# EAGLE design Pong Hat voor Raspberry Pi Rev 3 SOIC (EAGLE 7.3.0)
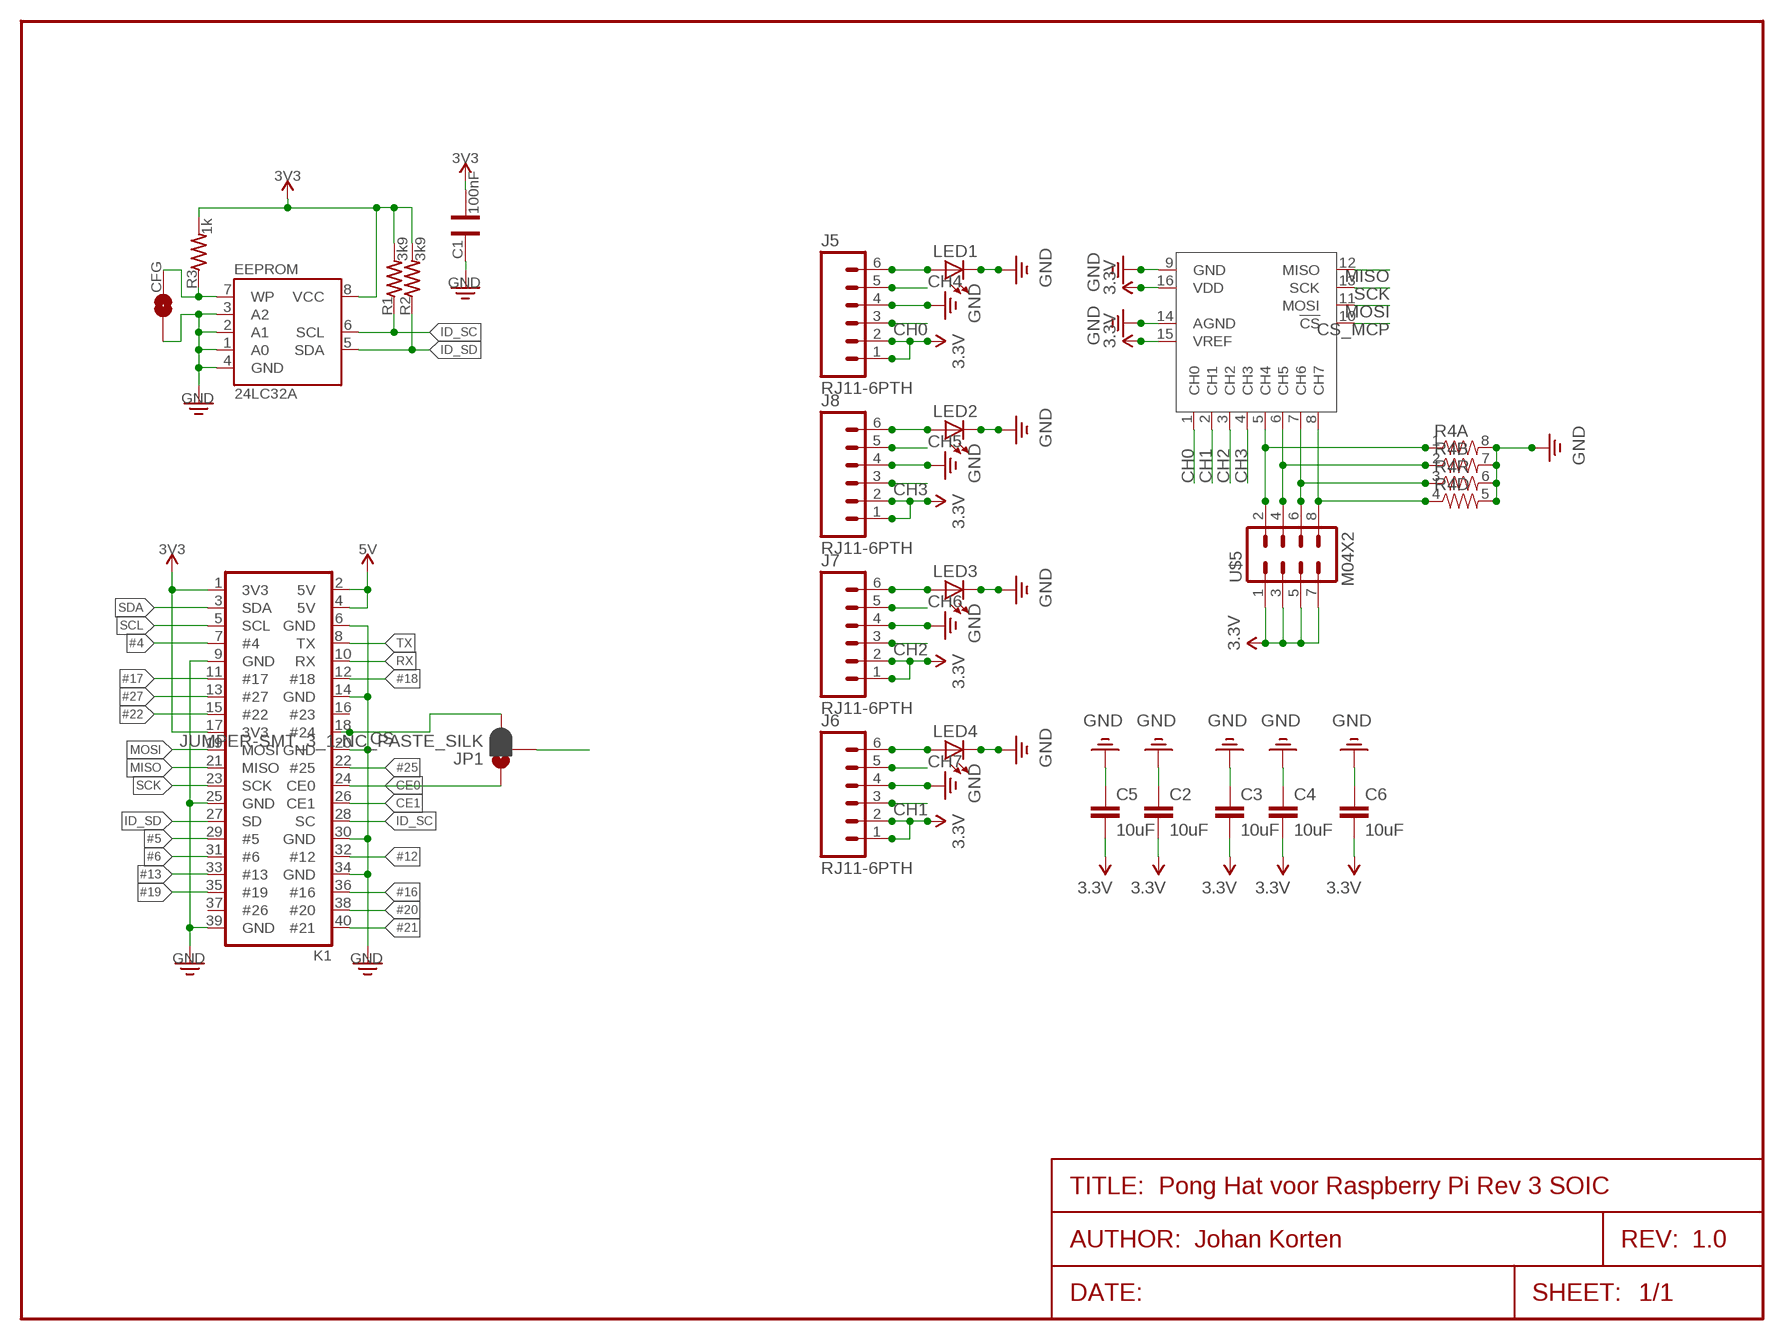
[diagram p0: schematic, sheet 1]
FRAME1 (FRAME-LETTER): AUTHOR: Johan Korten; REV: 1.0

## Parts
C1  100nF  CAP0603  [CAP-0603]
C2  10uF  10UF-0805-10V-10%  [0805]
C3  10uF  10UF-0805-10V-10%  [0805]
C4  10uF  10UF-0805-10V-10%  [0805]
C5  10uF  10UF-0805-10V-10%  [0805]
C6  10uF  10UF-0805-10V-10%  [0805]
CFG  1X02-SJ-NO  [1X02-SJ-NO]
EEPROM  24LC32A  [SO08-EIAJ]
J5  RJ11-6PTH  [RJ11-6]
J6  RJ11-6PTH  [RJ11-6]
J7  RJ11-6PTH  [RJ11-6]
J8  RJ11-6PTH  [RJ11-6]
JP1  JUMPER-SMT_3_1-NC_PASTE_SILK  [SMT-JUMPER_3_1-NC_PASTE_SILK]
K1  2X20-RPI-ALT  [2X20-RPI-ALT]
LED1  LEDCHIP-LED0805  [CHIP-LED0805]
LED2  LEDCHIP-LED0805  [CHIP-LED0805]
LED3  LEDCHIP-LED0805  [CHIP-LED0805]
LED4  LEDCHIP-LED0805  [CHIP-LED0805]
R1  3k9  RES0603  [RES-0603]
R2  3k9  RES0603  [RES-0603]
R3  1k  RES0603  [RES-0603]
R4  RESISTOR-ARRAY0603-ARV  [0603-ARV]
U$5  M04X2  [2X4]
U$7  MCP3008SL  [SO16]

## Nets
3.3V: C1.1 C2.2 C3.2 C4.2 C5.2 C6.2 EEPROM.8(VCC) J5.1 J5.2 J6.1 J6.2 J7.1 J7.2 J8.1 J8.2 K1.1(3V3) K1.17(3V3) R1.2 R2.2 R3.2 U$5.1 U$5.3 U$5.5 U$5.7 U$7.15(VREF) U$7.16(VDD) ; supply symbol labelled 3V3
5V: K1.2(5V) K1.4(5V)
#4: K1.7(#4)
#5: K1.29(#5)
#6: K1.31(#6)
#12: K1.32(#12)
#13: K1.33(#13)
#16: K1.36(#16)
#17: K1.11(#17)
#18: K1.12(#18)
#19: K1.35(#19)
#20: K1.38(#20)
#21: K1.40(#21)
#22: K1.15(#22)
#25: K1.22(#25)
#27: K1.13(#27)
CE0: JP1.1 K1.24(CE0)
CE1: K1.26(CE1)
CH0: J5.3 U$7.1(CH0)
CH1: J6.3 U$7.2(CH1)
CH2: J7.3 U$7.3(CH2)
CH3: J8.3 U$7.4(CH3)
CH4: J5.5 R4.1 U$5.2 U$7.5(CH4)
CH5: J8.5 R4.2 U$5.4 U$7.6(CH5)
CH6: J7.5 R4.3 U$5.6 U$7.7(CH6)
CH7: J6.5 R4.4 U$5.8 U$7.8(CH7)
CS: JP1.3 K1.18(#24)
CS_MCP: JP1.2 U$7.10(!CS)
GND: C1.2 C2.1 C3.1 C4.1 C5.1 C6.1 CFG.1 EEPROM.1(A0) EEPROM.2(A1) EEPROM.3(A2) EEPROM.4(GND) J5.4 J6.4 J7.4 J8.4 K1.6(GND) K1.9(GND) K1.14(GND) K1.20(GND) K1.25(GND) K1.30(GND) K1.34(GND) K1.39(GND) LED1.C LED2.C LED3.C LED4.C R4.5 R4.6 R4.7 R4.8 U$7.9(GND) U$7.14(AGND)
ID_SC: EEPROM.6(SCL) K1.28(SC) R1.1
ID_SD: EEPROM.5(SDA) K1.27(SD) R2.1
MISO: K1.21(MISO) U$7.12(MISO)
MOSI: K1.19(MOSI) U$7.11(MOSI)
N$1: J8.6 LED2.A
N$2: J7.6 LED3.A
N$3: CFG.2 EEPROM.7(WP) R3.1
N$4: J6.6 LED4.A
N$16: J5.6 LED1.A
RX: K1.10(RX)
SCK: K1.23(SCK) U$7.13(SCK)
SCL: K1.5(SCL)
SDA: K1.3(SDA)
TX: K1.8(TX)
Unconnected: K1.16(#23) K1.37(#26)

## Library data of the parts
C1 = Ai_Passives:CAP; DIELECTRIC: X7R
C2-C6 = SparkFun-Capacitors:10UF: 10.0µF ceramic capacitors A capacitor is a passive two-terminal electrical component used to store electrical energy temporarily in an electric field.; PROD_ID: CAP-11330
CFG = Ai_Connectors:1X02-SJ-NO: A.I. Device 1x02-SJ-* NC has a large amount of paste (see paste layer) so that it should jumper during reflow. Remember that we have a version with a buil-in trace, which needs to be cut in order to have the jumper be NO.
EEPROM = Ai_IC:24LC32A
J5-J8 = SparkFun:RJ11-6: RJ11 Jack Simple 6 pin RJ11 jack. Commonly found on CAT3 devices and Microchip programmers. SKU: PRT-00132
JP1 = SparkFun-Jumpers:JUMPER-SMT_3_1-NC_PASTE: Normally closed solder jumper (1 of 2 connections) This jumper has an aperture in the stencil to allow solder paste to bridge one of the two connections. One connection is normally closed (NC), while the other is normally open (NO). Wick off the solder to open the connection. Reapply solder to reclose the connection. Apply solder to the other side instead to change the current path.
K1 = Ai_Connectors:2X20-RPI
LED1-LED4 = adafruit:LED: LED OSRAM: - CHIPLED LG R971, LG N971, LY N971, LG Q971, LY Q971, LO R971, LY R971 LH N974, LH R974 LS Q976, LO Q976, LY Q976 LO Q996 - Hyper CHIPLED LW Q18S LB Q993, LB Q99A, LB R99A - SideLED LS A670, LO A670, LY A670, LG A670, LP A670 LB A673, LV A673, LT A673, LW A673 LH A674 LY A675 LS A676, LA A676, LO A676, LY A676, LW A676 LS A679, LY A679, LG A679 - Hyper Micro SIDELED® LS Y876, LA Y876, LO Y876, LY Y876 LT Y87S - SmartLED LW L88C, LW L88S LB L89C, LB L89S, LG L890 LS L89K, LO L89K, LY L89K LS L896, LA L896, LO L896, LY L896 - TOPLED LS T670, LO T670, LY T670, LG T670, LP T670 LSG T670, LSP T670, LSY T670, LOP T670, LYG T670 LG T671, LOG T671, LSG T671 LB T673, LV T673, LT T673, LW T673 LH T674 LS T676, LA T676, LO T676, LY T676, LB T676, LH T676, LSB T676, LW T676 LB T67C, LV T67C, LT T67C, LS T67K, LO T67K, LY T67K, LW E67C LS E67B, LA E67B, LO E67B, LY E67B, LB E67C, LV E67C, LT E67C LW T67C LS T679, LY T679, LG T679 LS T770, LO T770, LY T770, LG T770, LP T770 LB T773, LV T773, LT T773, LW T773 LH T774 LS E675, LA E675, LY E675, LS T675 LS T776, LA T776, LO T776, LY T776, LB T776 LHGB T686 LT T68C, LB T68C - Hyper Mini TOPLED® LB M676 - Mini TOPLED Santana® LG M470 LS M47K, LO M47K, LY M47K Source: http://www.osram.convergy.de/
R1-R3 = Ai_Passives:RES: Part # blah Digikey; TOLERANCE: 5%
R4 = SparkFun-Resistors:RESISTOR-ARRAY: Array Chip Resistor Source: RS Component / Phycomp
U$5 = SparkFun:M04X2
U$7 = MCP3008:MCP3008

## Board
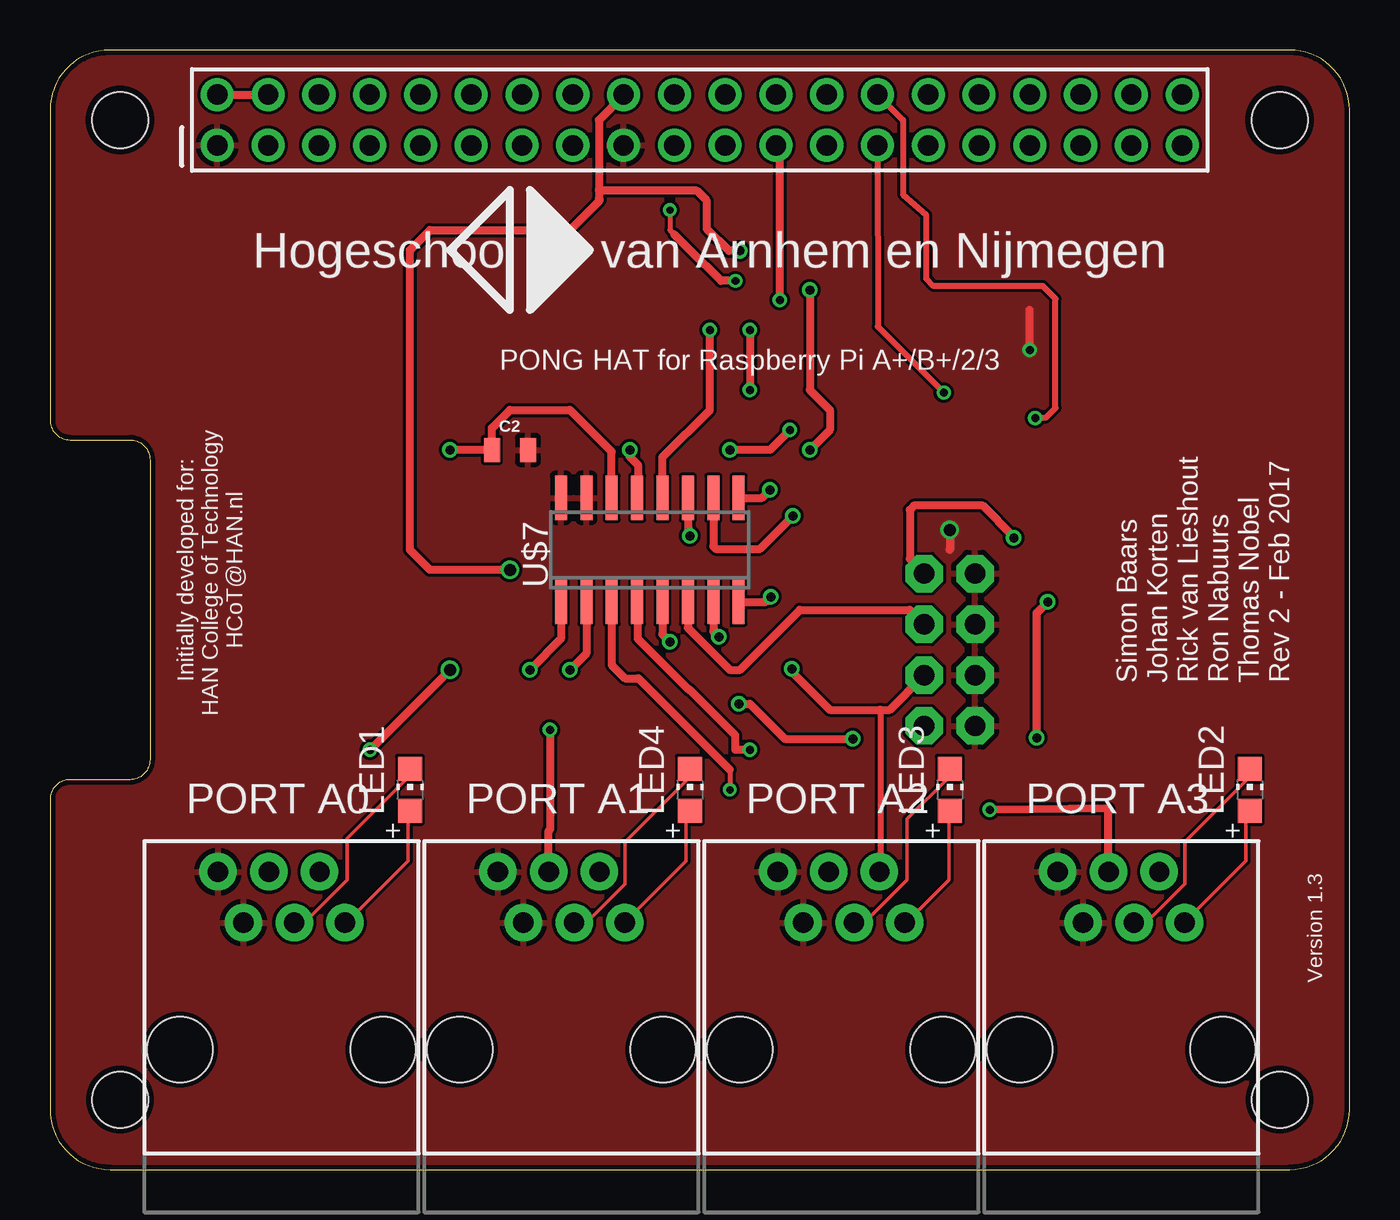
[diagram p1: board, top side]
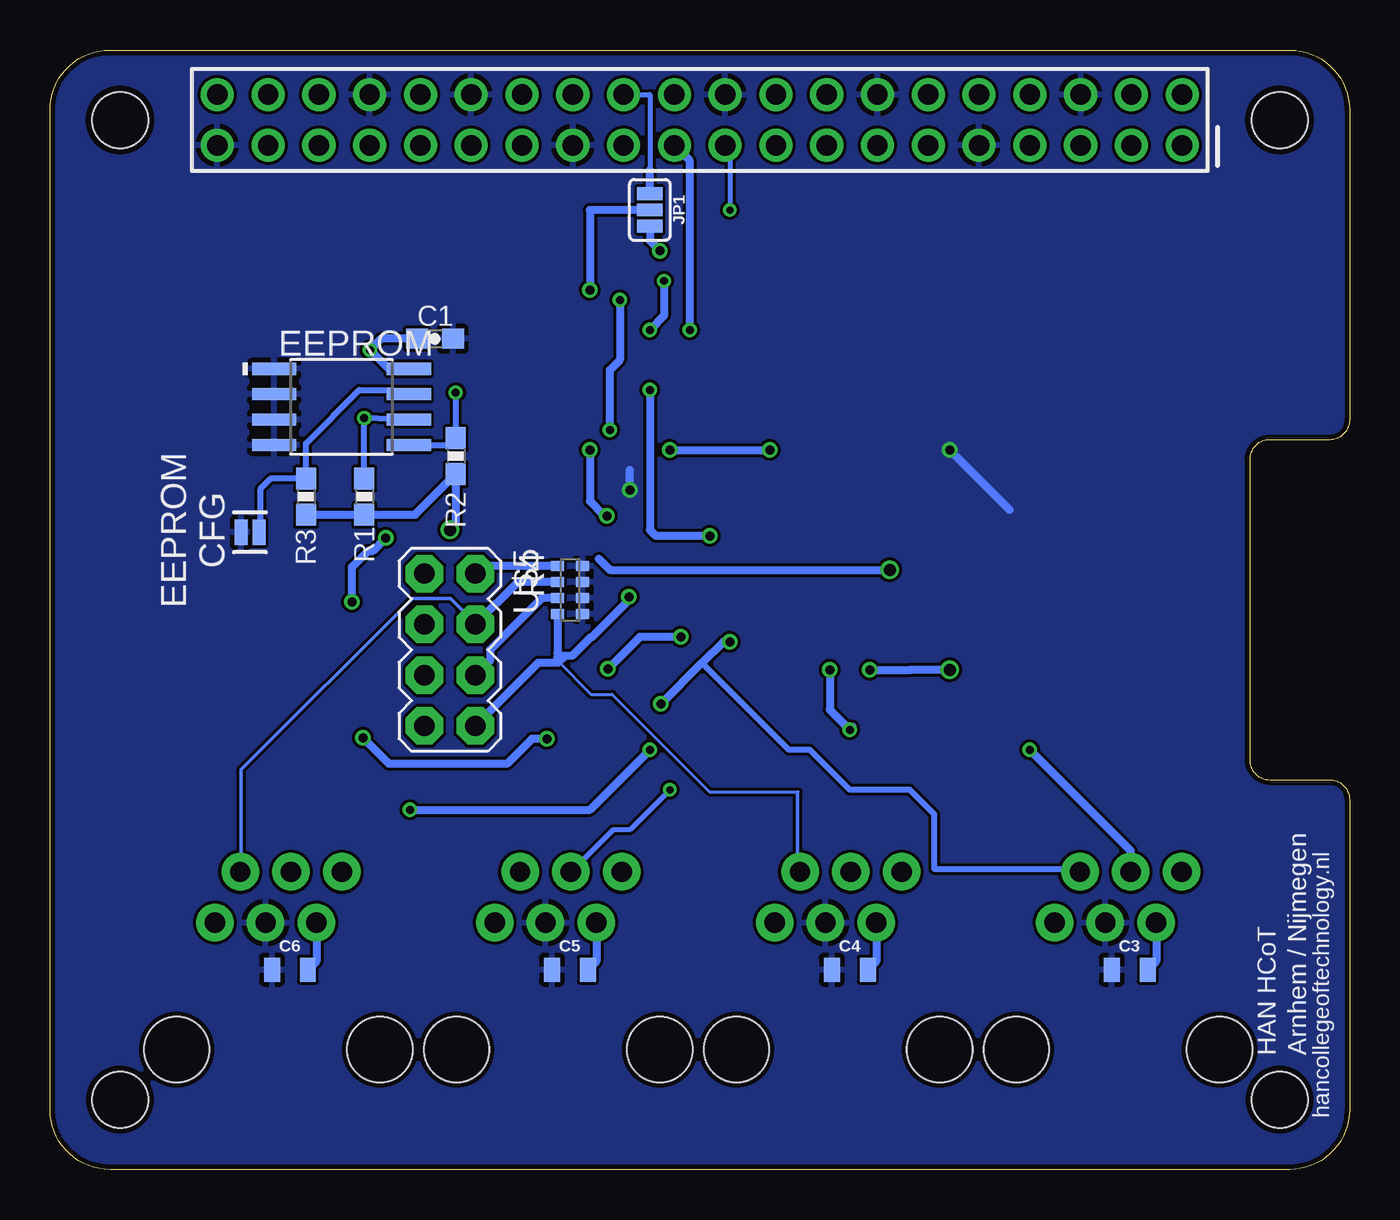
[diagram p2: board, bottom side, seen from below]

Size 65 x 56 mm. Coordinates in mm from the lower left corner, seen from the top.
Outline: 0,3 arc90 3,0 62,0 arc90 65,3 65,53 arc90 62,56 3,56 arc90 0,53 0,37.5 arc90 1,36.5 4,36.5 arc-90 5,35.5 5,20.5 arc-90 4,19.5 1,19.5 arc90 0,18.5 0,3
Copper layers (1*16): Top 0.035mm / dielectric 1.5mm / Bottom 0.035mm
Design rules "ITEADstudioDRC": minimum track width 6mil, minimum drill 12mil, track to track 6mil, track to pad 6mil, pad to pad 6mil, via to via 6mil, smd to smd 0mil, copper to edge 10mil, drill to drill 10mil, minimum pad ring 10mil, minimum via ring 6mil, stop-mask expansion 2mil, vias tented up to drill 100mil, thermal gap 10mil
Holes 2.8 mm at 3.5,3.5 3.5,52.5 61.5,52.5 61.5,3.5
tRestrict: area 1.9,51 to 5,54; area 60,51 to 63,54; area 60,1.9 to 63,5; area 1.9,1.9 to 5,5
bRestrict: area 1.9,1.9 to 5,5; area 1.9,51 to 5,54; area 60,1.9 to 63,5; area 60,51 to 63,54

### Footprints (pad centres in the part's own frame; a part is rotated, then mirrored left to right if it is on the bottom)
CAP-0603 = smd 1.1 x 1: 1 -0.9,0; 2 0.9,0
0805 = smd 0.8 x 1.2: 1 -0.9,0; 2 0.9,0
1X02-SJ-NO = smd 0.635 x 1.27: 1 -0.45,0; 2 0.45,0
SO08-EIAJ = smd 0.61 x 2.21: 1 -1.905,-3.378; 2 -0.635,-3.378; 3 0.635,-3.378; 4 1.905,-3.378; 5 1.905,3.353; 6 0.635,3.353; 7 -0.635,3.353; 8 -1.905,3.353
RJ11-6 = drill 1.016 pad 1.88: 1 1.905,8.89; 2 3.175,6.35; 3 4.445,8.89; 4 5.715,6.35; 5 6.985,8.89; 6 8.255,6.35 | hole 3.251: 0,0; 10.16,0
SMT-JUMPER_3_1-NC_PASTE_SILK = smd 0.635 x 1.27: 1 -0.813,0; 2 0,0; 3 0.813,0
2X20-RPI-ALT = drill 1.016 pad 1.651: 1 -24.13,-1.27; 2 -24.13,1.27; 3 -21.59,-1.27; 4 -21.59,1.27; 5 -19.05,-1.27; 6 -19.05,1.27; 7 -16.51,-1.27; 8 -16.51,1.27; 9 -13.97,-1.27; 10 -13.97,1.27; 11 -11.43,-1.27; 12 -11.43,1.27; 13 -8.89,-1.27; 14 -8.89,1.27; 15 -6.35,-1.27; 16 -6.35,1.27; 17 -3.81,-1.27; 18 -3.81,1.27; 19 -1.27,-1.27; 20 -1.27,1.27; 21 1.27,-1.27; 22 1.27,1.27; 23 3.81,-1.27; 24 3.81,1.27; 25 6.35,-1.27; 26 6.35,1.27; 27 8.89,-1.27; 28 8.89,1.27; 29 11.43,-1.27; 30 11.43,1.27; 31 13.97,-1.27; 32 13.97,1.27; 33 16.51,-1.27; 34 16.51,1.27; 35 19.05,-1.27; 36 19.05,1.27; 37 21.59,-1.27; 38 21.59,1.27; 39 24.13,-1.27; 40 24.13,1.27
CHIP-LED0805 = smd 1.2 x 1.2: A 0,-1.05; C 0,1.05
RES-0603 = smd 1.1 x 1: 1 -0.9,0; 2 0.9,0
0603-ARV = smd 0.5 x 0.65: 1 -1.2,-0.625; 2 -0.4,-0.625; 3 0.4,-0.625; 4 1.2,-0.625; 5 1.2,0.625; 6 0.4,0.625; 7 -0.4,0.625; 8 -1.2,0.625
2X4 = drill 1.016 pad 1.88 octagon: 1 -3.81,-1.27; 2 -3.81,1.27; 3 -1.27,-1.27; 4 -1.27,1.27; 5 1.27,-1.27; 6 1.27,1.27; 7 3.81,-1.27; 8 3.81,1.27
SO16 = smd 0.6 x 2.2: 1 -4.445,-2.6; 2 -3.175,-2.6; 3 -1.905,-2.6; 4 -0.635,-2.6; 5 0.635,-2.6; 6 1.905,-2.6; 7 3.175,-2.6; 8 4.445,-2.6; 9 4.445,2.6; 10 3.175,2.6; 11 1.905,2.6; 12 0.635,2.6; 13 -0.635,2.6; 14 -1.905,2.6; 15 -3.175,2.6; 16 -4.445,2.6

### Placement (x,y rotation side)
C1  45.75,41.55 0 bottom
C2  23,36 0 top
C3  11,10 0 bottom
C4  25,10 0 bottom
C5  39,10 0 bottom
C6  53,10 0 bottom
CFG  54.99,31.88 0 bottom
EEPROM  50.41,38.15 270 bottom
J5  6.5,6 0 top
J6  20.5,6 0 top
J7  34.5,6 0 top
J8  48.5,6 0 top
JP1  35,48 270 bottom
K1  32.5,52.5 0 top
LED1  18,19 0 top
LED2  60,19 0 top
LED3  45,19 0 top
LED4  32,19 0 top
R1  49.28,33.66 270 bottom
R2  44.7,35.69 270 bottom
R3  52.2,33.66 270 bottom
R4  39,29 270 bottom
U$5  45,26 270 bottom
U$7  30,31 0 top

### Tracks (layer width: path | path; a pad name or v marks a point on that pad's centre or on a via)
3.3V  (via drill 0.4, 0.6)
  Top 0.406: v49,41 49,43 | v45,32 45,31
  Bottom 0.305: 52.25,32.7 R3.2
  Bottom 0.406: EEPROM.8 48.05,40.05 v49,41 48.45,41.55 C1.1 46.65,41.65 | R3.2 R1.2 46.74,32.76 R2.2 44.7,32.3 v45,32 | J5.2 9.68,10.43 C3.2 | J6.2 23.68,10.43 C4.2 | J7.2 37.67,10.43 C5.2 | J8.2 51.67,10.43 C6.2
  pour Top: 0,3 arc90 3,0 62,0 arc90 65,3 65,53 arc90 62,56 3,56 arc90 0,53 0,37.5 arc90 1,36.5 4,36.5 arc-90 5,35.5 5,20.5 arc-90 4,19.5 1,19.5 arc90 0,18.5
5V
  Top 0.406: K1.2 K1.4
CE0
  Bottom 0.254: K1.24 35,53.77 35,50
  Bottom 0.406: JP1.1 35,50
CH0  (via drill 0.4, 0.45, 0.6)
  Top 0.406: v16,21 v20,25 | U$7.1 25.55,26.55 v24,25
  Bottom 0.406: J5.3 10.95,15.95 v16,21 | v20,25 21,25 21.95,25 v24,25
CH1  (via drill 0.4, 0.45)
  Top 0.406: v25,22 25,17 24.95,16.95 J6.3 | U$7.2 26.82,25.82 v26,25
  Bottom 0.406: 24.84,22.16 v25,22 26,23 v26,25
CH2  (via drill 0.35)
  Top 0.254: 34,20 v34,19
  Top 0.406: U$7.3 28.09,25.25 28.77,24.57 29.43,24.57 34,20
  Bottom 0.254: v34,19 36,17 36.84,17 J7.3
CH3  (via drill 0.4)
  Top 0.406: J8.3 52.95,18.05 v47,18 | v35,21 34.28,21 34.28,21.72 32,24 31.95,24 29.4,26.55 29.4,28.36 U$7.4
  Bottom 0.406: v47,18 38,18 v35,21
CH4  (via drill 0.45)
  Top 0.406: U$7.5 30.64,26.77 v31,26.4 | v34.45,23.3 35,23.3 36.75,21.55 v40.15,21.55 | v49.35,21.6 49.35,27.85 v49.9,28.4 | v48.2,31.6 48.2,31.65 46.65,33.2 43.2,33.2 43,33 43,30.54 U$5.2
  Bottom 0.178: 13.53,15.05 J5.5
  Bottom 0.305: 13.53,15.05 20.77,15.05 20.77,17.77 22,19 25,19 27,21 28.05,21 32.38,25.34
  Bottom 0.406: R4.1 43.34,30.2 U$5.2 | v31,26.4 31.32,26.4 32.38,25.34 32.41,25.34 v34.45,23.3 | v40.15,21.55 40.9,21.55 42.15,20.3 48.05,20.3 v49.35,21.6 | v49.9,28.4 49.9,30.15 49.1,30.95 48.85,30.95 v48.2,31.6
CH5
  Top 0.406: U$5.4 43,28 37.5,28 34.5,25 34,25 31.91,27.09 U$7.6
  Bottom 0.178: J8.5 55.44,15.05 55.44,20 46.86,28.57 44.96,28.57 43.81,27.43 U$5.4
  Bottom 0.406: R4.2 41.6,29.4 U$5.4
CH6  (via drill 0.45)
  Top 0.178: 41.53,15.05 J7.5
  Top 0.305: 41.53,23 41.53,15.05
  Top 0.406: U$5.6 42,23 41.53,23 39,23 37.1,24.9 v37.1,25.05 | U$7.7 33.17,26.93 v33.45,26.65
  Bottom 0.406: R4.3 40.4,28.6 43,26 43,25.46 U$5.6 | v33.45,26.65 35.5,26.65 v37.1,25.05
CH7  (via drill 0.45)
  Top 0.406: U$7.8 35.8,28.4 v36.05,28.65
  Bottom 0.152: 39.62,25.45 37.95,23.77 36.88,23.77 32,18.9 27.58,18.9 27.62,18.86
  Bottom 0.178: 27.62,18.86 27.62,15.05 J6.5
  Bottom 0.406: R4.4 39.62,25.81 39.51,25.7 | U$5.8 40.56,25.36 39.59,25.36 39.25,25.7 | v36.05,28.65 36.05,28.5 37.95,26.6 38,26.6 38.9,25.7 39.25,25.7 | 39.25,25.7 39.51,25.7 | 39.62,25.45 39.62,25.59 39.51,25.7
CS  (via drill 0.45, 0.6)
  Top 0.406: v23,30 19,30 18,31 18,46 19,47 26,47 27.5,48.5 27.45,48.55 27.45,49 | K1.18 28.69,53.74 27.45,52.5 27.45,49 | v34.5,45.95 33.95,45.95 32.85,47.05 32.85,48.45 32.35,48.95 27.5,48.95 27.45,49
  Bottom 0.406: 37.54,30.54 37,30 v23,30 | JP1.3 35,46.45 v34.5,45.95
CS_MCP  (via drill 0.45)
  Top 0.406: v38,44 38,39 39,38 39,37 v38,36 | U$7.10 33.17,31.18 33.3,31.05 35.5,31.05 v37.15,32.7
  Bottom 0.406: JP1.2 38,48 v38,44 | v38,36 38,33.43 37.27,32.7 v37.15,32.7
GND  (via drill 0.45)
  Top 0.178: LED1.C 17.91,20 17.91,19.62 14.86,16.57 14.86,14.48 12.76,12.38 12.38,12.38 J5.4 | LED4.C 31.81,20 31.81,19.43 28.77,16.38 28.77,14.29 26.86,12.38 26.29,12.38 J6.4 | LED3.C 44.96,20 44.96,19.62 42.86,17.53 42.86,14.48 40.77,12.38 40.39,12.38 J7.4 | LED2.C 59.82,20 59.82,19.43 56.77,16.38 56.77,14.29 54.86,12.38 54.29,12.38 J8.4
  Top 0.406: v20,36 C2.1 22.1,37.1 23,38 26,38 28.09,35.91 U$7.14 | U$7.9 35.6,33.6 v36,34
  Bottom 0.406: v20,36 17,33 | v36,34 36,35
  pour Bottom: 0,3 arc90 3,0 62,0 arc90 65,3 65,53 arc90 62,56 3,56 arc90 0,53 0,37.5 arc90 1,36.5 4,36.5 arc-90 5,35.5 5,20.5 arc-90 4,19.5 1,19.5 arc90 0,18.5
ID_SC  (via drill 0.4 pad 0.25)
  Top 0.305: K1.28 42.67,52.49 42.67,48.77 43.81,47.75 43.81,44.58 44.2,44.2 49.66,44.2 50.29,43.56 50.29,38.1 49.78,37.59 v49.28,37.59
  Bottom 0.305: EEPROM.6 47.17,37.51 v49.28,37.59 R1.1
ID_SD  (via drill 0.4 pad 0.25)
  Top 0.305: K1.27 41.4,42.16 v44.7,38.86
  Bottom 0.305: EEPROM.5 45.05,36.24 R2.1 v44.7,38.86
MISO  (via drill 0.4)
  Top 0.406: v33,42 33,38 30.64,35.63 U$7.12
  Bottom 0.406: v33,42 33,50.46 K1.21
MOSI  (via drill 0.35, 0.38, 0.4, 0.45)
  Top 0.254: v31,48 31,47 32,46
  Top 0.406: v35,42 v35,39 | v34.29,44.45 33.55,44.45 32,46 31.23,46.77 | U$7.11 31.91,31.8 v32,31.7
  Bottom 0.254: K1.19 31,51.23 v31,48
  Bottom 0.406: v34.29,44.45 34.29,42.71 v35,42 | v35,39 35,32 34.7,31.7 v32,31.7
N$1
  Top 0.178: LED2.A 59.82,17.91 59.82,15.43 56.77,12.38 J8.6
N$2
  Top 0.178: LED3.A 44.96,17.91 44.96,14.48 42.86,12.38 J7.6
N$3
  Bottom 0.305: EEPROM.7 47.13,38.86 47.75,38.86 47.88,38.99 49.53,38.99 52.2,36.32 R3.1 53.96,34.55 54.48,34.04 54.48,31.93 CFG.2
N$4
  Top 0.178: LED4.A 31.81,17.91 31.81,15.43 28.77,12.38 J6.6
N$16
  Top 0.178: LED1.A 17.91,17.91 17.91,15.43 14.86,12.38 J5.6
SCK  (via drill 0.4, 0.45)
  Top 0.406: v36.5,43.5 36.5,51.04 K1.23 | v37,37 36,36 v34,36 | v29,36 29,35.65 29.4,35.25 29.4,33.63 U$7.13
  Bottom 0.406: v37,37 37,40 36.5,40.5 v36.5,43.5 | v34,36 v29,36

### Text on the board
tPlace: PONG HAT for Raspberry Pi A+/B+/2/3 | Simon Baars / Johan Korten / Rick van Lieshout / Ron Nabuurs / Thomas Nobel / Rev 2 - Feb 2017 | PORT A0 | PORT A1 | PORT A2 | PORT A3 | Version 1.3
bPlace: EEPROM / CFG | Arnhem / Nijmegen | HAN HCoT | hancollegeoftechnology.nl
_tsilk: Hogeschool van Arnhem en Nijmegen | Initially developed for: / HAN College of Technology / HCoT@HAN.nl